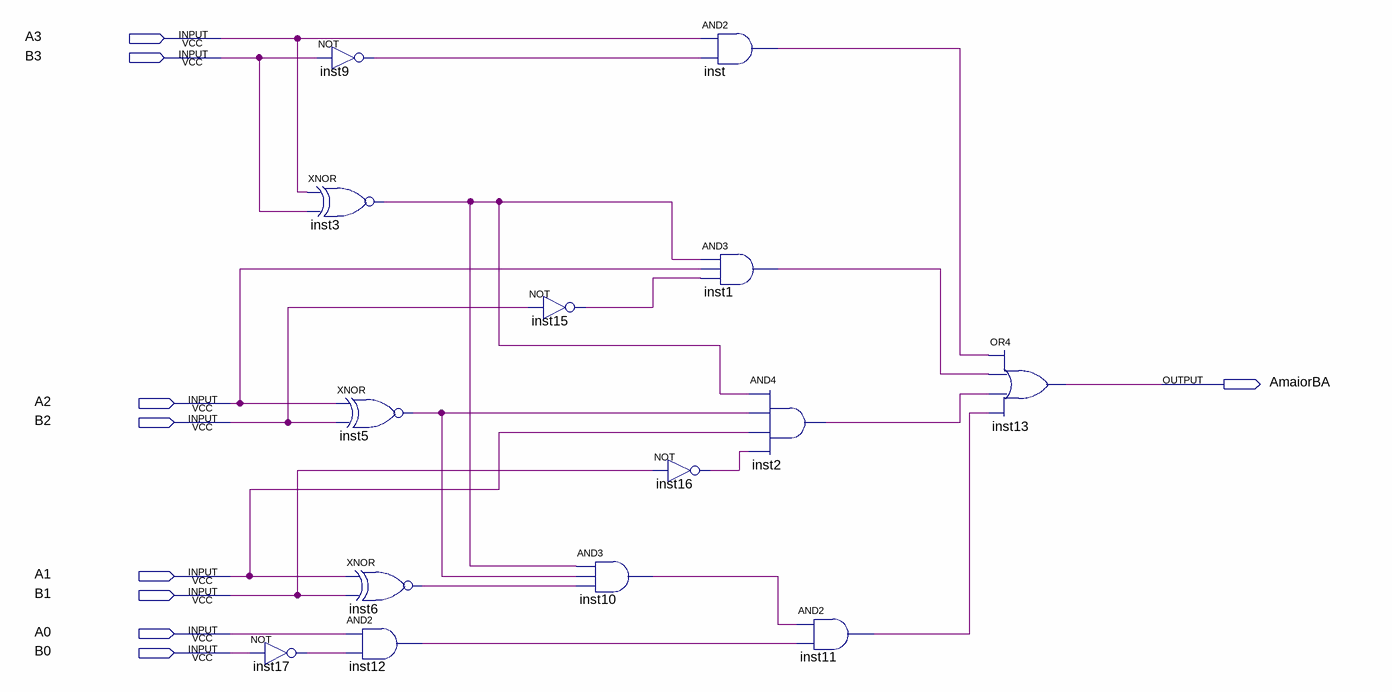
[diagram p0: schematic sheet]
// Quartus schematic Comparator_A_maior_B.bdf as structural Verilog: 14 symbols, 9 pins
module Comparator_A_maior_B (
  input  A3,
  input  B3,
  input  A2,
  input  B2,
  input  A1,
  input  B1,
  input  A0,
  input  B0,
  output AmaiorBA
);

  wire inst1_out, inst2_out, inst3_out, inst5_out, inst6_out, inst9_out, inst10_out, inst11_out, inst12_out,
       inst15_out, inst16_out, inst17_out, inst_out;

  not inst17 (inst17_out, B0);
  not inst9 (inst9_out, B3);
  xnor inst3 (inst3_out, A3, B3);
  xnor inst5 (inst5_out, A2, B2);
  xnor inst6 (inst6_out, A1, B1);
  and inst12 (inst12_out, A0, inst17_out);
  not inst15 (inst15_out, B2);
  and inst10 (inst10_out, inst3_out, inst5_out, inst6_out);
  not inst16 (inst16_out, B1);
  and inst (inst_out, A3, inst9_out);
  and inst1 (inst1_out, inst3_out, A2, inst15_out);
  and inst2 (inst2_out, inst3_out, inst5_out, A1, inst16_out);
  and inst11 (inst11_out, inst10_out, inst12_out);
  or inst13 (AmaiorBA, inst_out, inst1_out, inst2_out, inst11_out);
endmodule
